# EAGLE schematic main (EAGLE 9.6.2)
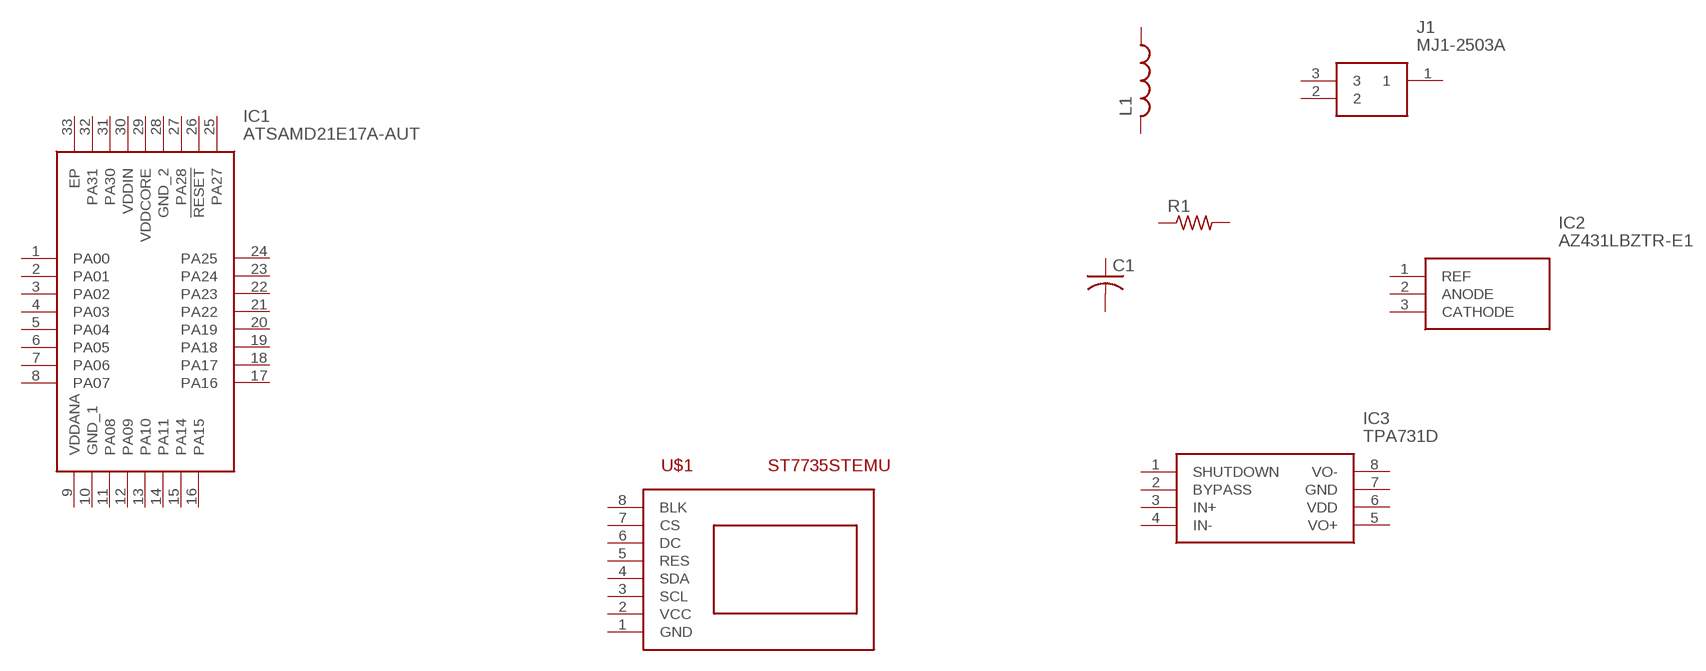
[diagram p0: schematic, sheet 1]

## Parts
C1  C-US050-024X044  [C050-024X044]
IC1  ATSAMD21E17A-AUT  [QFN50P500X500X100-33N]
IC2  AZ431LBZTR-E1  [AZ431LBZTRE1]
IC3  TPA731D  [SOIC127P600X175-8N]
J1  MJ1-2503A  [MJ12503A]
L1  L-US0204/7  [0204/7]
R1  R-US_0204/7  [0204/7]
U$1  ST7735STEMU  [ST7735S_NOSD]
Unconnected: C1.1 C1.2 IC1.1(PA00) IC1.2(PA01) IC1.3(PA02) IC1.4(PA03) IC1.5(PA04) IC1.6(PA05) IC1.7(PA06) IC1.8(PA07) IC1.9(VDDANA) IC1.10(GND_1) IC1.11(PA08) IC1.12(PA09) IC1.13(PA10) IC1.14(PA11) IC1.15(PA14) IC1.16(PA15) IC1.17(PA16) IC1.18(PA17) IC1.19(PA18) IC1.20(PA19) IC1.21(PA22) IC1.22(PA23) IC1.23(PA24) IC1.24(PA25) IC1.25(PA27) IC1.26(!RESET) IC1.27(PA28) IC1.28(GND_2) IC1.29(VDDCORE) IC1.30(VDDIN) IC1.31(PA30) IC1.32(PA31) IC1.33(EP) IC2.1(REF) IC2.2(ANODE) IC2.3(CATHODE) IC3.1(SHUTDOWN) IC3.2(BYPASS) IC3.3(IN+) IC3.4(IN-) IC3.5(VO+) IC3.8(VO-) J1.1 J1.2 J1.3 L1.1 L1.2 R1.1 R1.2 U$1.1(GND) U$1.2(VCC) U$1.3(SCL) U$1.4(SDA) U$1.5(RES) U$1.6(DC) U$1.7(CS) U$1.8(BLK)

## Power pins joined to a net without a drawn wire
GND: IC3.7(GND)
VDD: IC3.6(VDD)

## Library data of the parts
C1 = rcl:C-US: CAPACITOR, American symbol; SPICEPREFIX: C
IC1 = ATSAMD21E17A-AUT:ATSAMD21E17A-AUT: IC MCU 32BIT 128KB FLASH 32TQFP Source: Datasheet <https://4donline.ihs.com/images/VipMasterIC/IC/MCHP/MCHP-S-A0011993473/MCHP-S-A0013581487-1.pdf?hkey=EF798316E3902B6ED9A73243A3159BB0>; DESCRIPTION: IC MCU 32BIT 128KB FLASH 32TQFP; HEIGHT: 1mm; MANUFACTURER_NAME: Microchip; MANUFACTURER_PART_NUMBER: ATSAMD21E17A-AUT; MOUSER_PART_NUMBER: 556-ATSAMD21E17A-AUT; MOUSER_PRICE-STOCK: https://www.mouser.co.uk/ProductDetail/Microchip-Technology/ATSAMD21E17A-AUT?qs=KLFHFgXTQiBLmA2MEeDLVA%3D%3D
IC2 = AZ431LBZTR-E1:AZ431LBZTR-E1: Voltage References Adj Prec Shunt Reg 1.24V to 18V 3mV Source: Datasheet <https://www.diodes.com/assets/Datasheets/AZ431L.pdf>; DESCRIPTION: Voltage References Adj Prec Shunt Reg 1.24V to 18V 3mV; HEIGHT: 8.7mm; MANUFACTURER_NAME: Diodes Inc.; MANUFACTURER_PART_NUMBER: AZ431LBZTR-E1; MOUSER_PART_NUMBER: 621-AZ431LBZTR-E1; MOUSER_PRICE-STOCK: https://www.mouser.co.uk/ProductDetail/Diodes-Incorporated/AZ431LBZTR-E1?qs=FKu9oBikfSmXZc2hlLrlkw%3D%3D
IC3 = TPA731D:TPA731D: 700-mW Mono, Differential Input, Class-AB Audio Amplifier with Active High Shutdown Source: Datasheet <http://www.ti.com/lit/gpn/tpa731>; DESCRIPTION: 700-mW Mono, Differential Input, Class-AB Audio Amplifier with Active High Shutdown; HEIGHT: 1.75mm; MANUFACTURER_NAME: Texas Instruments; MANUFACTURER_PART_NUMBER: TPA731D; MOUSER_PART_NUMBER: 595-TPA731D; MOUSER_PRICE-STOCK: https://www.mouser.com/Search/Refine.aspx?Keyword=595-TPA731D
J1 = MJ1-2503A:MJ1-2503A: AUDIOJACK, 2.5MM, RT, MONO, TH Source: Datasheet <https://www.cui.com/product/resource/mj1-2503a.pdf>; DESCRIPTION: AUDIOJACK, 2.5MM, RT, MONO, TH; HEIGHT: 5mm; MANUFACTURER_NAME: CUI Devices; MANUFACTURER_PART_NUMBER: MJ1-2503A; MOUSER_PART_NUMBER: 490-MJ1-2503A; MOUSER_PRICE-STOCK: https://www.mouser.co.uk/ProductDetail/CUI-Devices/MJ1-2503A?qs=WyjlAZoYn53Vmgniye7ciw%3D%3D
L1 = rcl:L-US: INDUCTOR, American symbol; SPICEPREFIX: L
R1 = rcl:R-US_: RESISTOR, American symbol; SPICEPREFIX: R
U$1 = ST7735wosd:ST7735STEMU